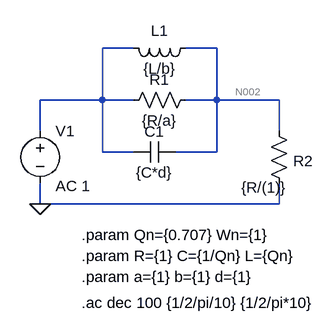
[diagram p0: schematic Ej2-b.asc]
Ej2-b.asc, the LTspice schematic file:
Version 4
SHEET 1 880 680
WIRE 0 96 -48 96
WIRE 128 96 80 96
WIRE -48 176 -48 96
WIRE -48 176 -144 176
WIRE 0 176 -48 176
WIRE 128 176 128 96
WIRE 128 176 80 176
WIRE 224 176 128 176
WIRE -144 224 -144 176
WIRE 224 224 224 176
WIRE -48 256 -48 176
WIRE 0 256 -48 256
WIRE 128 256 128 176
WIRE 128 256 64 256
WIRE -144 336 -144 304
WIRE 224 336 224 304
WIRE 224 336 -144 336
FLAG -144 336 0
SYMBOL ind 96 80 R90
WINDOW 0 5 56 VBottom 2
WINDOW 3 32 56 VTop 2
SYMATTR InstName L1
SYMATTR Value {L/b}
SYMBOL res 96 160 R90
WINDOW 0 0 56 VBottom 2
WINDOW 3 32 56 VTop 2
SYMATTR InstName R1
SYMATTR Value {R/a}
SYMBOL cap 64 240 R90
WINDOW 0 0 32 VBottom 2
WINDOW 3 32 32 VTop 2
SYMATTR InstName C1
SYMATTR Value {C*d}
SYMBOL res 208 208 R0
WINDOW 0 38 62 Left 2
WINDOW 3 -42 103 Left 2
SYMATTR InstName R2
SYMATTR Value {R/(1)}
SYMBOL voltage -144 208 R0
WINDOW 123 24 100 Left 2
WINDOW 39 0 0 Left 0
SYMATTR Value2 AC 1
SYMATTR InstName V1
SYMATTR Value ""
TEXT -80 384 Left 2 !.param Qn={0.707} Wn={1}
TEXT -80 416 Left 2 !.param R={1} C={1/Qn} L={Qn}
TEXT -80 448 Left 2 !.param a={1} b={1} d={1}
TEXT -80 488 Left 2 !.ac dec 100 {1/2/pi/10} {1/2/pi*10}

The netlist it stands for:
* Ej2-b.asc
L1 N002 N001 {L/b}
R1 N002 N001 {R/a}
C1 N002 N001 {C*d}
R2 N002 0 {R/(1)}
V1 N001 0 AC 1
.param Qn={0.707} Wn={1}
.param R={1} C={1/Qn} L={Qn}
.param a={1} b={1} d={1}
.ac dec 100 {1/2/pi/10} {1/2/pi*10}
.backanno
.end

* Results of the author's LTspice run, read from the files saved beside the schematic
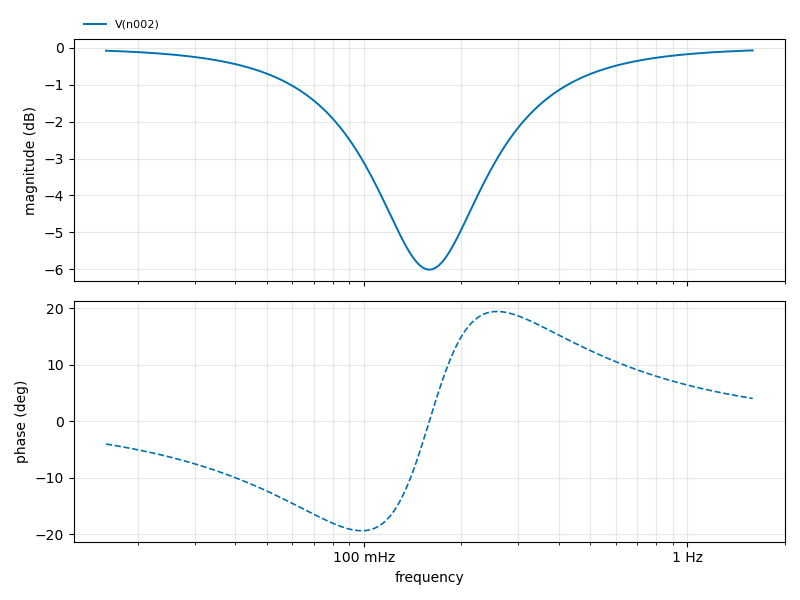
[diagram p1: AC Analysis of Ej2-b.asc, plotted from the saved traces]
* AC Analysis, 1 run:
*   V(n002): -0.07 dB at 15.92 mHz, -0.07 dB at 1.592 Hz, peak -0.07 dB at 1.592 Hz, 3 dB below the peak at 255 mHz